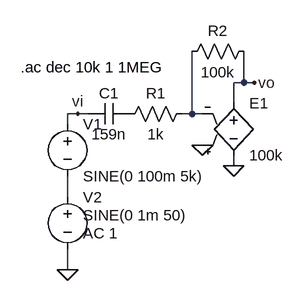
[diagram p0: schematic passaalta.asc]
passaalta.asc, the LTspice schematic file:
Version 4
SHEET 1 880 680
WIRE 240 112 240 64
WIRE 240 112 224 112
WIRE 256 112 240 112
WIRE 224 144 224 112
WIRE -16 160 -32 160
WIRE 0 160 -16 160
WIRE 160 160 160 64
WIRE 160 160 144 160
WIRE 176 160 160 160
WIRE -32 176 -32 160
WIRE 224 240 224 224
WIRE -32 288 -32 256
WIRE -32 400 -32 368
FLAG 176 208 0
FLAG 224 240 0
FLAG 256 112 vo
FLAG -16 160 vi
FLAG -32 400 0
SYMBOL cap 64 144 R90
WINDOW 0 0 32 VBottom 2
WINDOW 3 32 32 VTop 2
SYMATTR InstName C1
SYMATTR Value 159n
SYMBOL res 160 144 R90
WINDOW 0 0 56 VBottom 2
WINDOW 3 32 56 VTop 2
SYMATTR InstName R1
SYMATTR Value 1k
SYMBOL e2 224 128 R0
SYMATTR InstName E1
SYMATTR Value 100k
SYMBOL voltage -32 160 R0
WINDOW 123 0 0 Left 2
WINDOW 39 0 0 Left 2
SYMATTR InstName V1
SYMATTR Value SINE(0 100m 5k)
SYMBOL res 256 48 R90
WINDOW 0 0 56 VBottom 2
WINDOW 3 32 56 VTop 2
SYMATTR InstName R2
SYMATTR Value 100k
SYMBOL voltage -32 272 R0
WINDOW 3 24 44 Left 2
WINDOW 123 24 72 Left 2
WINDOW 39 0 0 Left 2
SYMATTR InstName V2
SYMATTR Value SINE(0 1m 50)
SYMATTR Value2 AC 1
TEXT -104 88 Left 2 !.ac dec 10k 1 1MEG

The netlist it stands for:
* passaalta.asc
C1 P001 vi 159n
R1 N001 P001 1k
E1 vo 0 0 N001 100k
V1 vi N002 SINE(0 100m 5k)
R2 vo N001 100k
V2 N002 0 SINE(0 1m 50) AC 1
.ac dec 10k 1 1MEG
.backanno
.end